# Altium schematic sheet Reader_PN5108.SchDoc: PNEV5180B
size A3; Date: 15.9.2015; DrawnBy: GVR; Address1: A3; Revision: 2.0; SheetNumber: 3; SheetTotal: 3
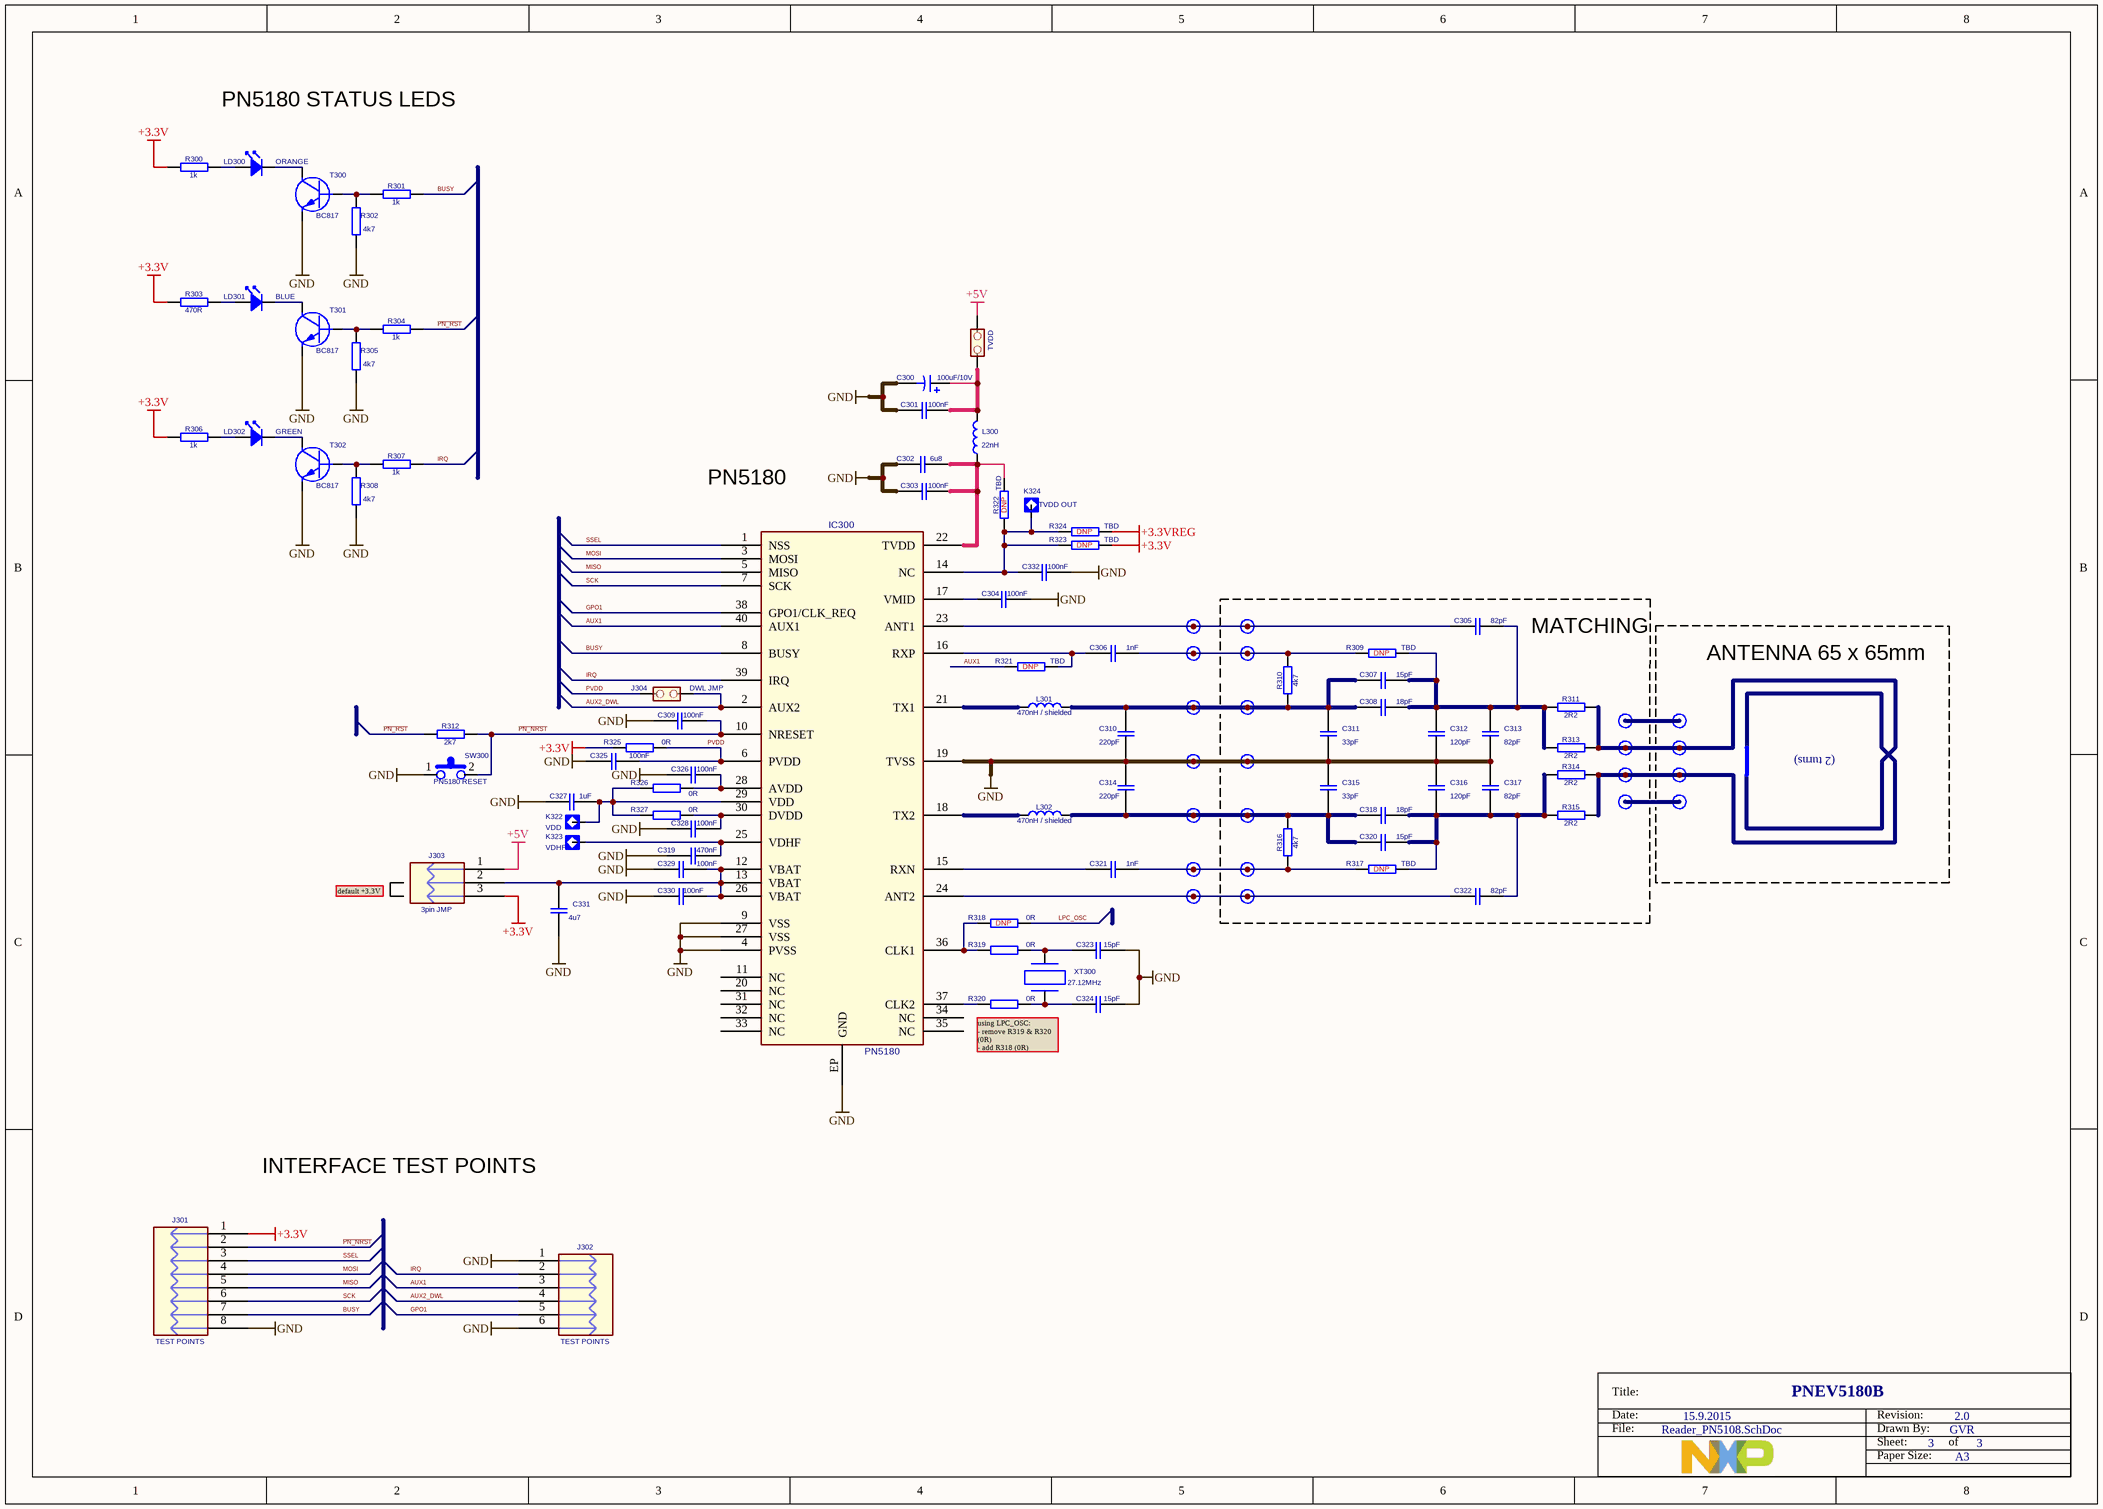
[diagram p0: Reader_PN5108.SchDoc]

## Parts
?  (no value)
C300  100uF/10V  [C_TANTAL_B]
C301  100nF  [Y0603]
C302  6u8  [Y0603]
C303  100nF  [Y0603]
C304  100nF  [Y0603]
C305  82pF  [Y0805]
C306  1nF  [Y0805]
C307  15pF  [Y0805]
C308  18pF  [Y0805]
C309  100nF  [Y0603]
C310  220pF  [Y0805]
C311  33pF  [Y0805]
C312  120pF  [Y0805]
C313  82pF  [Y0805]
C314  220pF  [Y0805]
C315  33pF  [Y0805]
C316  120pF  [Y0805]
C317  82pF  [Y0805]
C318  18pF  [Y0805]
C319  470nF  [Y0603]
C320  15pF  [Y0805]
C321  1nF  [Y0805]
C322  82pF  [Y0805]
C323  15pF  [Y0603]
C324  15pF  [Y0603]
C325  100nF  [Y0402]
C326  100nF  [Y0603]
C327  1uF  [Y0603]
C328  100nF  [Y0603]
C329  100nF  [Y0402]
C330  100nF  [Y0402]
C331  4u7  [Y0603]
C332  100nF  [Y0603]
IC300  PN5180  [QFN50P600X600X100_HS-41N]
J300  TVDD  [CON2]
J301  value TEST POINTS  [CON8M-LINE]  (hidden comment: CON8M_LINE)
J302  value TEST POINTS  [CON6M-LINE]  (hidden comment: CON6M_LINE)
J303  3pin JMP  [CON3M-LINE]
J304  DWL JMP  [CON2]
K300  TP_1.0mm  [CON1_PIN_Round_1.0x1.8mm]  (value not drawn)
K301  TP_1.0mm  [CON1_PIN_Round_1.0x1.8mm]  (value not drawn)
K302  TP_1.0mm  [CON1_PIN_Round_1.0x1.8mm]  (value not drawn)
K303  TP_1.0mm  [CON1_PIN_Round_1.0x1.8mm]  (value not drawn)
K304  TP_1.0mm  [CON1_PIN_Round_1.0x1.8mm]  (value not drawn)
K305  TP_1.0mm  [CON1_PIN_Round_1.0x1.8mm]  (value not drawn)
K306  TP_1.0mm  [CON1_PIN_Round_1.0x1.8mm]  (value not drawn)
K307  TP_1.0mm  [CON1_PIN_Round_1.0x1.8mm]  (value not drawn)
K308  TP_1.0mm  [CON1_PIN_Round_1.0x1.8mm]  (value not drawn)
K309  TP_1.0mm  [CON1_PIN_Round_1.0x1.8mm]  (value not drawn)
K310  TP_1.0mm  [CON1_PIN_Round_1.0x1.8mm]  (value not drawn)
K311  TP_1.0mm  [CON1_PIN_Round_1.0x1.8mm]  (value not drawn)
K312  TP_1.0mm  [CON1_PIN_Round_1.0x1.8mm]  (value not drawn)
K313  TP_1.0mm  [CON1_PIN_Round_1.0x1.8mm]  (value not drawn)
K314  TP_1.0mm  [CON1_PIN_Round_1.0x1.8mm]  (value not drawn)
K315  TP_1.0mm  [CON1_PIN_Round_1.0x1.8mm]  (value not drawn)
K316  TP_1.0mm  [CON1_PIN_Round_1.0x1.8mm]  (value not drawn)
K317  TP_1.0mm  [CON1_PIN_Round_1.0x1.8mm]  (value not drawn)
K318  TP_1.0mm  [CON1_PIN_Round_1.0x1.8mm]  (value not drawn)
K319  TP_1.0mm  [CON1_PIN_Round_1.0x1.8mm]  (value not drawn)
K320  TP_1.0mm  [CON1_PIN_Round_1.0x1.8mm]  (value not drawn)
K321  TP_1.0mm  [CON1_PIN_Round_1.0x1.8mm]  (value not drawn)
K322  value VDD  [TESTP_ROUND_1.0mm]  (hidden comment: TP1)
K323  value VDHF  [TESTP_ROUND_1.0mm]  (hidden comment: TP1)
K324  value TVDD OUT  [TESTP_ROUND_1.0mm]  (hidden comment: TP1)
L300  22nH  [Y0805]
L301  value 470nH / shielded  [INDCC_1812_1210]  (hidden comment: 470nH / shielded (1210))
L302  value 470nH / shielded  [INDCC_1812_1210]  (hidden comment: 470nH / shielded (1210))
LD300  ORANGE  [LED_0603]
LD301  BLUE  [LED_0603]
LD302  GREEN  [LED_0603]
NT1  Net_Tie  [Net_Tie_SMT_0.406mm]  (value not drawn)  (net tie, no BOM)
R300  1k  [Y0603]
R301  1k  [Y0603]
R302  4k7  [Y0603]
R303  470R  [Y0603]
R304  1k  [Y0603]
R305  4k7  [Y0603]
R306  1k  [Y0603]
R307  1k  [Y0603]
R308  4k7  [Y0603]
R309  value TBD  [Y0805]  (hidden comment: TBD DNP)
R310  4k7  [Y0805]
R311  2R2  [Y0805]
R312  2k7  [Y0603]
R313  2R2  [Y0805]
R314  2R2  [Y0805]
R315  2R2  [Y0805]
R316  4k7  [Y0805]
R317  value TBD  [Y0805]  (hidden comment: TBD DNP)
R318  value 0R  [Y0603]  (hidden comment: 0R DNP)
R319  0R  [Y0603]
R320  0R  [Y0603]
R321  value TBD  [Y0603]  (hidden comment: TBD DNP)
R322  value TBD  [Y0603]  (hidden comment: TBD DNP)
R323  value TBD  [Y0603]  (hidden comment: TBD DNP)
R324  value TBD  [Y0603]  (hidden comment: TBD DNP)
R325  0R  [Y0603]
R326  0R  [Y0603]
R327  0R  [Y0603]
SW300  DTSM-32S-B  [SW_DTSM-32S-B]  (value not drawn)
T300  BC817  [SOT-23]
T301  BC817  [SOT-23]
T302  BC817  [SOT-23]
XT300  27.12MHz  [QUARTZ_32SMX]

## Nets
+3.3V: J301.1(P1) J303.3(P3) R300.2 R303.2 R306.2 R323.1 R325.2
+3.3VREG: R324.1
+5V: J300.2 J303.1(P1)
GND: C300.2 C301.1 C302.2 C303.1 C304.1 C309.2 C310.1 C311.1 C312.1 C313.1 C314.2 C315.2 C316.2 C317.2 C319.2 C323.1 C324.1 C325.1 C326.2 C327.2 C328.2 C329.1 C330.1 C331.2 C332.1 IC300.4(PVSS) IC300.9(VSS) IC300.19(TVSS) IC300.27(VSS) IC300.EP(GND) J301.8(P8) J302.1(P1) J302.6(P6) K310.1 K311.1 R302.2 R305.2 R308.2 SW300.1 T300.2(E) T301.2(E) T302.2(E)
AUX1: IC300.40(AUX1) J302.3(P3) R321.2
AUX2_DWL: IC300.2(AUX2) J302.4(P4) J304.2
BUSY: IC300.8(BUSY) J301.7(P7) R301.2
GPO1: IC300.38(GPO1/CLK_REQ) J302.5(P5)
IRQ: IC300.39(IRQ) J302.2(P2) R307.2
LPC_OSC: R318.1
MISO: IC300.5(MISO) J301.5(P5)
MOSI: IC300.3(MOSI) J301.4(P4)
~{PN_NRST}: C309.1 IC300.10(NRESET) J301.2(P2) R312.2 SW300.2
~{PN_RST}: R304.2 R312.1
PVDD: C325.2 IC300.6(PVDD) J304.1 R325.1
SCK: IC300.7(SCK) J301.6(P6)
SSEL: IC300.1(NSS) J301.3(P3)
NetC300_1: C300.1 C301.2 J300.1 L300.2
NetC302_1: C302.1 C303.2 IC300.22(TVDD) L300.1 R322.1
NetC304_2: C304.2 IC300.17(VMID)
NetC305_1: C305.1 IC300.23(ANT1) K300.1 K301.1
NetC305_2: C305.2 C307.2 C308.2 C312.2 C313.2 R309.1 R311.2 R313.2
NetC306_1: C306.1 IC300.16(RXP) R321.1
NetC306_2: C306.2 K302.1 K303.1 R309.2 R310.1
NetC307_1: C307.1 C308.1 C310.2 C311.2 K304.1 K305.1 L301.2 R310.2
NetC314_1: C314.1 C315.1 C318.1 C320.1 K316.1 K317.1 L302.2 R316.1
NetC316_1: C316.1 C317.1 C318.2 C320.2 C322.2 R314.2 R315.2 R317.1
NetC319_1: C319.1 IC300.25(VDHF) K323.1
NetC321_1: C321.1 IC300.15(RXN)
NetC321_2: C321.2 K318.1 K319.1 R316.2 R317.2
NetC322_1: C322.1 IC300.24(ANT2) K320.1 K321.1
NetC323_2: C323.2 R319.1 XT300.3
NetC324_2: C324.2 R320.1 XT300.1
NetC326_1: C326.1 IC300.28(AVDD) R326.1
NetC327_1: C327.1 IC300.29(VDD) K322.1 R326.2 R327.2
NetC328_1: C328.1 IC300.30(DVDD) R327.1
NetC329_2: C329.2 C330.2 C331.1 IC300.12(VBAT) IC300.13(VBAT) IC300.26(VBAT) J303.2(P2)
NetC332_2: C332.2 IC300.14(NC) K324.1 R322.2 R323.2 R324.2
NetIC300_18: IC300.18(TX2) L302.1
NetIC300_21: IC300.21(TX1) L301.1
NetIC300_36: IC300.36(CLK1) R318.2 R319.2
NetIC300_37: IC300.37(CLK2) R320.2
NetK306_1: K306.1 K307.1
NetK308_1: K308.1 K309.1 NT1.1 R311.1 R313.1
NetK312_1: K312.1 K313.1 NT1.2 R314.1 R315.1
NetK314_1: K314.1 K315.1
NetLD300_1: LD300.1 T300.3(C)
NetLD300_2: LD300.2 R300.1
NetLD301_1: LD301.1 T301.3(C)
NetLD301_2: LD301.2 R303.1
NetLD302_1: LD302.1 T302.3(C)
NetLD302_2: LD302.2 R306.1
NetR301_1: R301.1 R302.1 T300.1(B)
NetR304_1: R304.1 R305.1 T301.1(B)
NetR307_1: R307.1 R308.1 T302.1(B)

Not connected (* = marked no-connect by the designer): IC300 11(NC) 20(NC) 31(NC) 32(NC) 33(NC) 34(NC) 35(NC); XT300 2 4

## Notes on the sheet
- PN5180 STATUS LEDS
- PN5180
- MATCHING
- ANTENNA 65 x 65mm
- (near NT1) (2 turns)
- default +3.3V
- (near R320) using LPC_OSC:
  - remove R319 & R320 (0R)
  - add R318 (0R)
- INTERFACE TEST POINTS
- Title:
- Date:
- File:
- Revision:
- Drawn By:
- Sheet:
- Paper Size:
- of
- (in symbol SWITCH_SMD) PN5180 RESET

## Library data of the parts
? = Title Block NXP
C300 = C_TANTAL_B: DNP: DNP; Value: 100uF/10V
C301-C304 C309 C319 C323 C324 C326-C328 C331 C332 = CAPC0603
  C301 C303 C304 C309 C326 C328 C332: Value: 100nF
  C302: Value: 6u8
  C319: Value: 470nF
  C323 C324: Value: 15pF
  C327: Value: 1uF
  C331: Value: 4u7
C305-C308 C310-C318 C320-C322 = CAPC0805
  C305 C313 C317 C322: Value: 82pF
  C306 C321: Value: 1nF
  C307 C320: Value: 15pF
  C308 C318: Value: 18pF
  C310 C314: Value: 220pF
  C311 C315: Value: 33pF
  C312 C316: Value: 120pF
C325 C329 C330 = CAPC0402: Value: 100nF
IC300 = PN5180: 13.56 MHz Reader; DNP: DNP; Value: PN5180
J300 J304 = JMP2: DNP: DNP
J303 = CON3M_LINE
K300-K321 = TP_1.0mm: Value: {Value}; DNP: DNP
L300 = INDC0805: Value: 22nH
L301 L302 = INDC1812
LD300-LD302 = LEDY0603: DNP: DNP
  LD300: Value: ORANGE
  LD301: Value: BLUE
  LD302: Value: GREEN
NT1 = Net_Tie: Component for shorting nets in design
R300-R308 R312 R318-R327 = RESC0603
  R300 R301 R304 R306 R307: Value: 1k
  R302 R305 R308: Value: 4k7
  R303: Value: 470R
  R312: Value: 2k7
  R318 R321-R324: DNP: DNP
  R319 R320 R325-R327: Value: 0R
R309-R311 R313-R317 = RESC0805
  R309 R317: DNP: DNP
  R310 R316: Value: 4k7; DNP: DNP
  R311 R313-R315: Value: 2R2
SW300 = SWITCH_SMD: DNP: DNP; Value: DTSM-32S-B
XT300 = QUARTZ_32SMX: Value: 27.12MHz
J301 = CON8M_LINE: DNP: DNP
J302 = CON6M_LINE: DNP: DNP